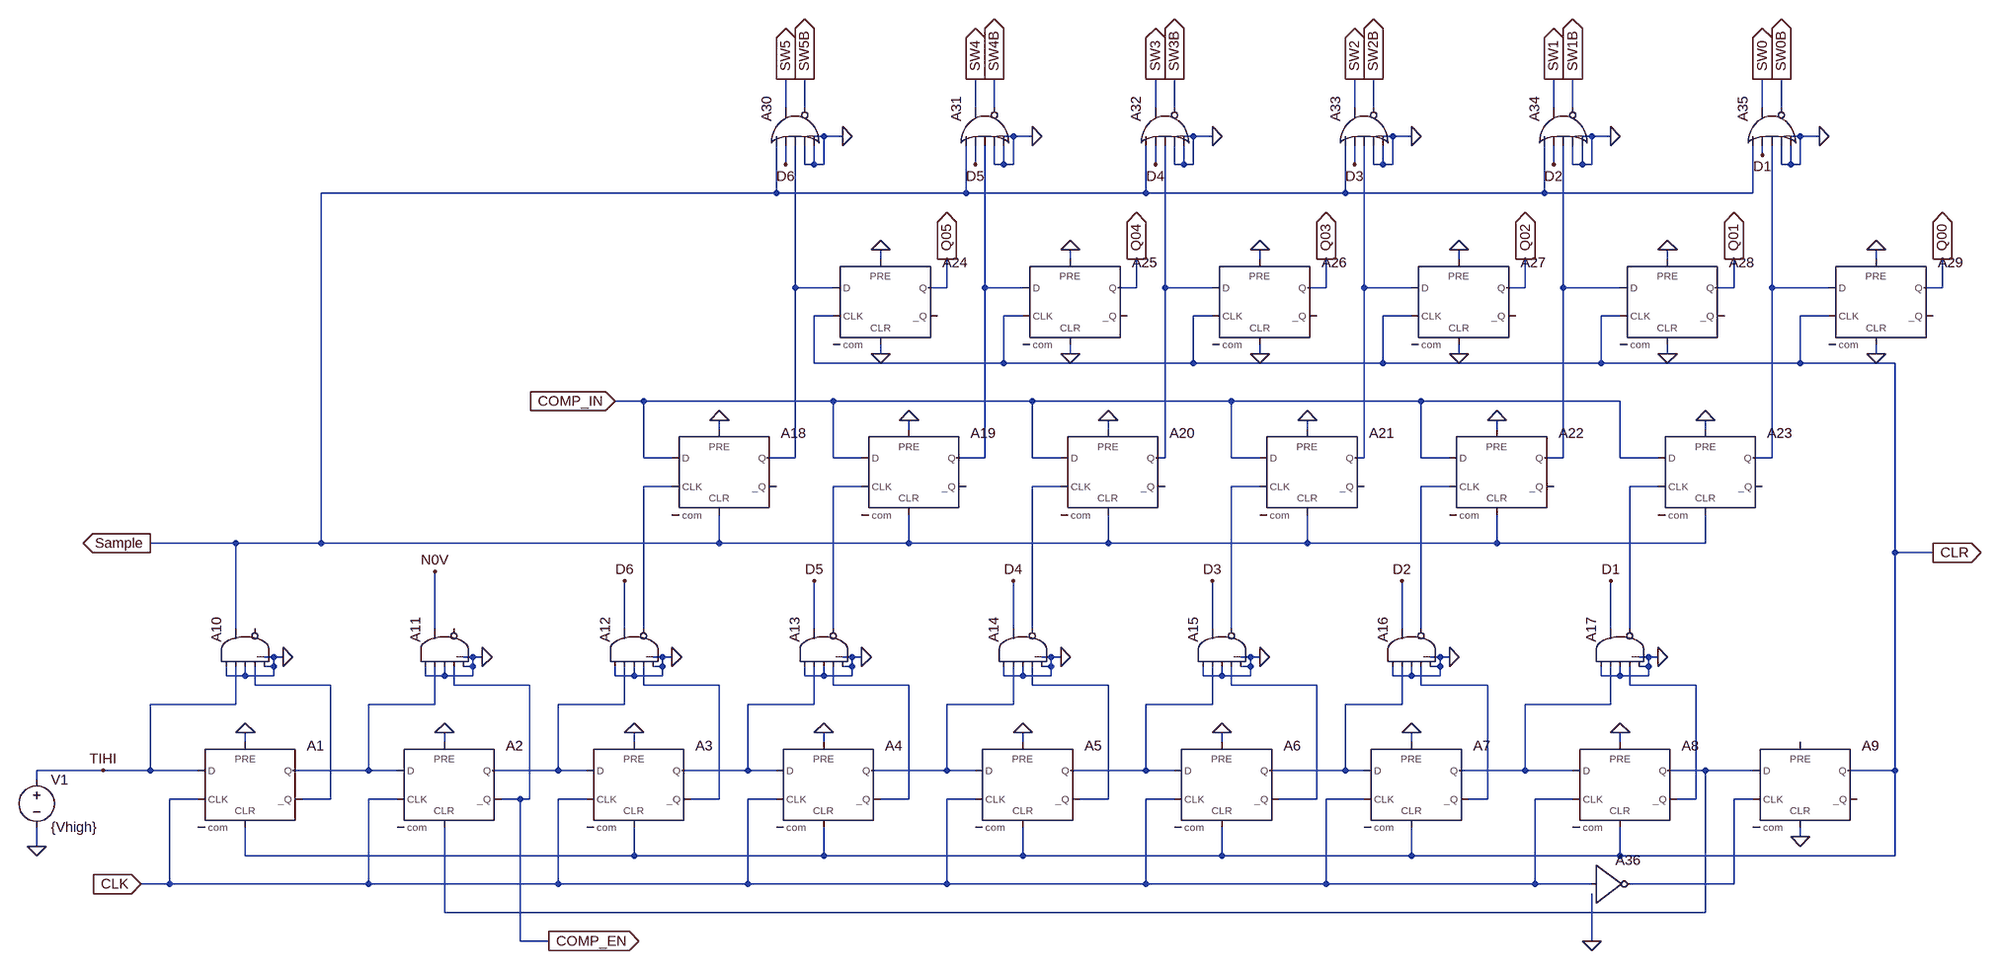
[diagram p0: schematic mySARLogic.asc]
mySARLogic.asc, the LTspice schematic file:
Version 4
SHEET 1 3236 680
WIRE 1152 -1072 1152 -1120
WIRE 1184 -1072 1184 -1120
WIRE 1472 -1072 1472 -1120
WIRE 1504 -1072 1504 -1120
WIRE 1776 -1072 1776 -1120
WIRE 1808 -1072 1808 -1120
WIRE 2112 -1072 2112 -1120
WIRE 2144 -1072 2144 -1120
WIRE 2448 -1072 2448 -1120
WIRE 2480 -1072 2480 -1120
WIRE 2800 -1072 2800 -1120
WIRE 2832 -1072 2832 -1120
WIRE 1216 -1024 1200 -1024
WIRE 1248 -1024 1216 -1024
WIRE 1536 -1024 1520 -1024
WIRE 1568 -1024 1536 -1024
WIRE 1840 -1024 1824 -1024
WIRE 1872 -1024 1840 -1024
WIRE 2176 -1024 2160 -1024
WIRE 2208 -1024 2176 -1024
WIRE 2512 -1024 2496 -1024
WIRE 2544 -1024 2512 -1024
WIRE 2864 -1024 2848 -1024
WIRE 2896 -1024 2864 -1024
WIRE 2800 -992 2800 -1008
WIRE 1152 -976 1152 -1008
WIRE 1184 -976 1184 -1008
WIRE 1200 -976 1200 -1008
WIRE 1200 -976 1184 -976
WIRE 1216 -976 1216 -1024
WIRE 1216 -976 1200 -976
WIRE 1472 -976 1472 -1008
WIRE 1504 -976 1504 -1008
WIRE 1520 -976 1520 -1008
WIRE 1520 -976 1504 -976
WIRE 1536 -976 1536 -1024
WIRE 1536 -976 1520 -976
WIRE 1776 -976 1776 -1008
WIRE 1808 -976 1808 -1008
WIRE 1824 -976 1824 -1008
WIRE 1824 -976 1808 -976
WIRE 1840 -976 1840 -1024
WIRE 1840 -976 1824 -976
WIRE 2112 -976 2112 -1008
WIRE 2144 -976 2144 -1008
WIRE 2160 -976 2160 -1008
WIRE 2160 -976 2144 -976
WIRE 2176 -976 2176 -1024
WIRE 2176 -976 2160 -976
WIRE 2448 -976 2448 -1008
WIRE 2480 -976 2480 -1008
WIRE 2496 -976 2496 -1008
WIRE 2496 -976 2480 -976
WIRE 2512 -976 2512 -1024
WIRE 2512 -976 2496 -976
WIRE 2832 -976 2832 -1008
WIRE 2848 -976 2848 -1008
WIRE 2848 -976 2832 -976
WIRE 2864 -976 2864 -1024
WIRE 2864 -976 2848 -976
WIRE 1136 -928 1136 -1008
WIRE 1136 -928 368 -928
WIRE 1456 -928 1456 -1008
WIRE 1456 -928 1136 -928
WIRE 1760 -928 1760 -1008
WIRE 1760 -928 1456 -928
WIRE 2096 -928 2096 -1008
WIRE 2096 -928 1760 -928
WIRE 2432 -928 2432 -1008
WIRE 2432 -928 2096 -928
WIRE 2784 -928 2784 -1008
WIRE 2784 -928 2432 -928
WIRE 1312 -816 1312 -832
WIRE 1632 -816 1632 -832
WIRE 1952 -816 1952 -832
WIRE 2288 -816 2288 -832
WIRE 2640 -816 2640 -832
WIRE 2992 -816 2992 -832
WIRE 1168 -768 1168 -1008
WIRE 1232 -768 1168 -768
WIRE 1424 -768 1424 -816
WIRE 1424 -768 1392 -768
WIRE 1488 -768 1488 -1008
WIRE 1552 -768 1488 -768
WIRE 1744 -768 1744 -816
WIRE 1744 -768 1712 -768
WIRE 1792 -768 1792 -1008
WIRE 1872 -768 1792 -768
WIRE 2064 -768 2064 -816
WIRE 2064 -768 2032 -768
WIRE 2128 -768 2128 -1008
WIRE 2208 -768 2128 -768
WIRE 2400 -768 2400 -816
WIRE 2400 -768 2368 -768
WIRE 2464 -768 2464 -1008
WIRE 2560 -768 2464 -768
WIRE 2752 -768 2752 -816
WIRE 2752 -768 2720 -768
WIRE 2816 -768 2816 -1008
WIRE 2912 -768 2816 -768
WIRE 3104 -768 3104 -816
WIRE 3104 -768 3072 -768
WIRE 1232 -720 1200 -720
WIRE 1552 -720 1520 -720
WIRE 1872 -720 1840 -720
WIRE 2208 -720 2160 -720
WIRE 2560 -720 2528 -720
WIRE 2912 -720 2864 -720
WIRE 1312 -656 1312 -672
WIRE 1632 -656 1632 -672
WIRE 1952 -656 1952 -672
WIRE 2288 -656 2288 -672
WIRE 2640 -656 2640 -672
WIRE 2992 -656 2992 -672
WIRE 1200 -640 1200 -720
WIRE 1520 -640 1520 -720
WIRE 1520 -640 1200 -640
WIRE 1840 -640 1840 -720
WIRE 1840 -640 1520 -640
WIRE 2160 -640 2160 -720
WIRE 2160 -640 1840 -640
WIRE 2528 -640 2528 -720
WIRE 2528 -640 2160 -640
WIRE 2864 -640 2864 -720
WIRE 2864 -640 2528 -640
WIRE 3024 -640 2864 -640
WIRE 912 -576 864 -576
WIRE 1232 -576 912 -576
WIRE 1568 -576 1232 -576
WIRE 1904 -576 1568 -576
WIRE 2224 -576 1904 -576
WIRE 2560 -576 2224 -576
WIRE 1040 -528 1040 -544
WIRE 1360 -528 1360 -544
WIRE 1696 -528 1696 -544
WIRE 2032 -528 2032 -544
WIRE 2352 -528 2352 -544
WIRE 2704 -528 2704 -544
WIRE 912 -480 912 -576
WIRE 960 -480 912 -480
WIRE 1168 -480 1168 -768
WIRE 1168 -480 1120 -480
WIRE 1232 -480 1232 -576
WIRE 1280 -480 1232 -480
WIRE 1488 -480 1488 -768
WIRE 1488 -480 1440 -480
WIRE 1568 -480 1568 -576
WIRE 1616 -480 1568 -480
WIRE 1792 -480 1792 -768
WIRE 1792 -480 1776 -480
WIRE 1904 -480 1904 -576
WIRE 1952 -480 1904 -480
WIRE 2128 -480 2128 -768
WIRE 2128 -480 2112 -480
WIRE 2224 -480 2224 -576
WIRE 2272 -480 2224 -480
WIRE 2464 -480 2464 -768
WIRE 2464 -480 2432 -480
WIRE 2560 -480 2560 -576
WIRE 2624 -480 2560 -480
WIRE 2816 -480 2816 -768
WIRE 2816 -480 2784 -480
WIRE 960 -432 912 -432
WIRE 1280 -432 1232 -432
WIRE 1616 -432 1568 -432
WIRE 1952 -432 1904 -432
WIRE 2272 -432 2224 -432
WIRE 2624 -432 2576 -432
WIRE 224 -336 80 -336
WIRE 368 -336 368 -928
WIRE 368 -336 224 -336
WIRE 1040 -336 1040 -384
WIRE 1040 -336 368 -336
WIRE 1360 -336 1360 -384
WIRE 1360 -336 1040 -336
WIRE 1696 -336 1696 -384
WIRE 1696 -336 1360 -336
WIRE 2032 -336 2032 -384
WIRE 2032 -336 1696 -336
WIRE 2352 -336 2352 -384
WIRE 2352 -336 2032 -336
WIRE 2704 -336 2704 -384
WIRE 2704 -336 2352 -336
WIRE 3024 -320 3024 -640
WIRE 3088 -320 3024 -320
WIRE 224 -192 224 -336
WIRE 560 -192 560 -288
WIRE 880 -192 880 -272
WIRE 912 -192 912 -432
WIRE 1200 -192 1200 -272
WIRE 1232 -192 1232 -432
WIRE 1536 -192 1536 -272
WIRE 1568 -192 1568 -432
WIRE 1872 -192 1872 -272
WIRE 1904 -192 1904 -432
WIRE 2192 -192 2192 -272
WIRE 2224 -192 2224 -432
WIRE 2544 -192 2544 -272
WIRE 2576 -192 2576 -432
WIRE 288 -144 272 -144
WIRE 304 -144 288 -144
WIRE 624 -144 608 -144
WIRE 640 -144 624 -144
WIRE 944 -144 928 -144
WIRE 960 -144 944 -144
WIRE 1264 -144 1248 -144
WIRE 1280 -144 1264 -144
WIRE 1600 -144 1584 -144
WIRE 1616 -144 1600 -144
WIRE 1936 -144 1920 -144
WIRE 1952 -144 1936 -144
WIRE 2256 -144 2240 -144
WIRE 2272 -144 2256 -144
WIRE 2608 -144 2592 -144
WIRE 2624 -144 2608 -144
WIRE 288 -128 288 -144
WIRE 288 -128 272 -128
WIRE 624 -128 624 -144
WIRE 624 -128 608 -128
WIRE 944 -128 944 -144
WIRE 944 -128 928 -128
WIRE 1264 -128 1264 -144
WIRE 1264 -128 1248 -128
WIRE 1600 -128 1600 -144
WIRE 1600 -128 1584 -128
WIRE 1936 -128 1936 -144
WIRE 1936 -128 1920 -128
WIRE 2256 -128 2256 -144
WIRE 2256 -128 2240 -128
WIRE 2608 -128 2608 -144
WIRE 2608 -128 2592 -128
WIRE 208 -112 208 -128
WIRE 240 -112 240 -128
WIRE 240 -112 208 -112
WIRE 288 -112 288 -128
WIRE 288 -112 240 -112
WIRE 544 -112 544 -128
WIRE 576 -112 576 -128
WIRE 576 -112 544 -112
WIRE 624 -112 624 -128
WIRE 624 -112 576 -112
WIRE 864 -112 864 -128
WIRE 896 -112 896 -128
WIRE 896 -112 864 -112
WIRE 944 -112 944 -128
WIRE 944 -112 896 -112
WIRE 1184 -112 1184 -128
WIRE 1216 -112 1216 -128
WIRE 1216 -112 1184 -112
WIRE 1264 -112 1264 -128
WIRE 1264 -112 1216 -112
WIRE 1520 -112 1520 -128
WIRE 1552 -112 1552 -128
WIRE 1552 -112 1520 -112
WIRE 1600 -112 1600 -128
WIRE 1600 -112 1552 -112
WIRE 1856 -112 1856 -128
WIRE 1888 -112 1888 -128
WIRE 1888 -112 1856 -112
WIRE 1936 -112 1936 -128
WIRE 1936 -112 1888 -112
WIRE 2176 -112 2176 -128
WIRE 2208 -112 2208 -128
WIRE 2208 -112 2176 -112
WIRE 2256 -112 2256 -128
WIRE 2256 -112 2208 -112
WIRE 2528 -112 2528 -128
WIRE 2560 -112 2560 -128
WIRE 2560 -112 2528 -112
WIRE 2608 -112 2608 -128
WIRE 2608 -112 2560 -112
WIRE 256 -96 256 -128
WIRE 384 -96 256 -96
WIRE 592 -96 592 -128
WIRE 720 -96 592 -96
WIRE 912 -96 912 -128
WIRE 1040 -96 912 -96
WIRE 1232 -96 1232 -128
WIRE 1360 -96 1232 -96
WIRE 1568 -96 1568 -128
WIRE 1696 -96 1568 -96
WIRE 1904 -96 1904 -128
WIRE 2048 -96 1904 -96
WIRE 2224 -96 2224 -128
WIRE 2336 -96 2224 -96
WIRE 2576 -96 2576 -128
WIRE 2688 -96 2576 -96
WIRE 224 -64 224 -128
WIRE 224 -64 80 -64
WIRE 560 -64 560 -128
WIRE 560 -64 448 -64
WIRE 880 -64 880 -128
WIRE 880 -64 768 -64
WIRE 1200 -64 1200 -128
WIRE 1200 -64 1088 -64
WIRE 1536 -64 1536 -128
WIRE 1536 -64 1424 -64
WIRE 1872 -64 1872 -128
WIRE 1872 -64 1760 -64
WIRE 2192 -64 2192 -128
WIRE 2192 -64 2096 -64
WIRE 2544 -64 2544 -128
WIRE 2544 -64 2400 -64
WIRE 240 0 240 -16
WIRE 576 0 576 -16
WIRE 896 0 896 -16
WIRE 1216 0 1216 -16
WIRE 1552 0 1552 -16
WIRE 1888 0 1888 -16
WIRE 2208 0 2208 -16
WIRE 2560 0 2560 -16
WIRE 0 48 -112 48
WIRE 80 48 80 -64
WIRE 80 48 0 48
WIRE 160 48 80 48
WIRE 448 48 448 -64
WIRE 448 48 320 48
WIRE 496 48 448 48
WIRE 768 48 768 -64
WIRE 768 48 656 48
WIRE 816 48 768 48
WIRE 1088 48 1088 -64
WIRE 1088 48 976 48
WIRE 1136 48 1088 48
WIRE 1424 48 1424 -64
WIRE 1424 48 1296 48
WIRE 1472 48 1424 48
WIRE 1760 48 1760 -64
WIRE 1760 48 1632 48
WIRE 1808 48 1760 48
WIRE 2096 48 2096 -64
WIRE 2096 48 1968 48
WIRE 2128 48 2096 48
WIRE 2400 48 2400 -64
WIRE 2400 48 2288 48
WIRE 2480 48 2400 48
WIRE 2704 48 2640 48
WIRE 2784 48 2704 48
WIRE 3024 48 3024 -320
WIRE 3024 48 2944 48
WIRE -112 64 -112 48
WIRE 160 96 112 96
WIRE 384 96 384 -96
WIRE 384 96 336 96
WIRE 496 96 448 96
WIRE 704 96 672 96
WIRE 720 96 720 -96
WIRE 720 96 704 96
WIRE 816 96 768 96
WIRE 1040 96 1040 -96
WIRE 1040 96 992 96
WIRE 1136 96 1088 96
WIRE 1360 96 1360 -96
WIRE 1360 96 1312 96
WIRE 1472 96 1424 96
WIRE 1696 96 1696 -96
WIRE 1696 96 1648 96
WIRE 1808 96 1760 96
WIRE 2048 96 2048 -96
WIRE 2048 96 1984 96
WIRE 2128 96 2064 96
WIRE 2336 96 2336 -96
WIRE 2336 96 2304 96
WIRE 2480 96 2416 96
WIRE 2688 96 2688 -96
WIRE 2688 96 2656 96
WIRE 2784 96 2752 96
WIRE 2864 160 2864 144
WIRE -112 176 -112 144
WIRE 240 192 240 144
WIRE 896 192 896 144
WIRE 896 192 240 192
WIRE 1216 192 1216 144
WIRE 1216 192 896 192
WIRE 1552 192 1552 144
WIRE 1552 192 1216 192
WIRE 1888 192 1888 144
WIRE 1888 192 1552 192
WIRE 2208 192 2208 144
WIRE 2208 192 1888 192
WIRE 2560 192 2560 144
WIRE 2560 192 2208 192
WIRE 3024 192 3024 48
WIRE 3024 192 2560 192
WIRE 112 240 112 96
WIRE 112 240 64 240
WIRE 448 240 448 96
WIRE 448 240 112 240
WIRE 768 240 768 96
WIRE 768 240 448 240
WIRE 1088 240 1088 96
WIRE 1088 240 768 240
WIRE 1424 240 1424 96
WIRE 1424 240 1088 240
WIRE 1760 240 1760 96
WIRE 1760 240 1424 240
WIRE 2064 240 2064 96
WIRE 2064 240 1760 240
WIRE 2416 240 2416 96
WIRE 2416 240 2064 240
WIRE 2512 240 2416 240
WIRE 2752 240 2752 96
WIRE 2752 240 2576 240
WIRE 576 288 576 144
WIRE 2704 288 2704 48
WIRE 2704 288 576 288
WIRE 704 336 704 96
WIRE 752 336 704 336
WIRE 2512 336 2512 256
FLAG 1248 -1024 0
FLAG 1040 -544 0
FLAG 1360 -544 0
FLAG 1696 -544 0
FLAG 2032 -544 0
FLAG 2352 -544 0
FLAG 2704 -544 0
FLAG 1312 -832 0
FLAG 1632 -832 0
FLAG 1952 -832 0
FLAG 2288 -832 0
FLAG 2640 -832 0
FLAG 2992 -832 0
FLAG 1312 -656 0
FLAG 1632 -656 0
FLAG 1952 -656 0
FLAG 2288 -656 0
FLAG 2640 -656 0
FLAG 2992 -656 0
FLAG 304 -144 0
FLAG 240 -16 0
FLAG 576 -16 0
FLAG 896 -16 0
FLAG 1216 -16 0
FLAG 1552 -16 0
FLAG 1888 -16 0
FLAG 2208 -16 0
FLAG 2560 -16 0
FLAG 640 -144 0
FLAG 960 -144 0
FLAG 1280 -144 0
FLAG 1616 -144 0
FLAG 1952 -144 0
FLAG 2272 -144 0
FLAG 2624 -144 0
FLAG 1568 -1024 0
FLAG 1872 -1024 0
FLAG 2208 -1024 0
FLAG 2544 -1024 0
FLAG 2896 -1024 0
FLAG 64 240 CLK
IOPIN 64 240 In
FLAG 864 -576 COMP_IN
IOPIN 864 -576 In
FLAG 752 336 COMP_EN
IOPIN 752 336 Out
FLAG -112 176 0
FLAG 2864 160 0
FLAG 2512 336 0
FLAG 80 -336 Sample
IOPIN 80 -336 Out
FLAG 880 -272 D6
FLAG 1200 -272 D5
FLAG 1536 -272 D4
FLAG 1872 -272 D3
FLAG 2192 -272 D2
FLAG 2544 -272 D1
FLAG 1424 -816 Q05
IOPIN 1424 -816 Out
FLAG 1744 -816 Q04
IOPIN 1744 -816 Out
FLAG 2064 -816 Q03
IOPIN 2064 -816 Out
FLAG 2400 -816 Q02
IOPIN 2400 -816 Out
FLAG 2752 -816 Q01
IOPIN 2752 -816 Out
FLAG 3104 -816 Q00
IOPIN 3104 -816 Out
FLAG 1152 -976 D6
FLAG 1472 -976 D5
FLAG 1776 -976 D4
FLAG 2112 -976 D3
FLAG 2448 -976 D2
FLAG 2800 -992 D1
FLAG 1152 -1120 SW5
IOPIN 1152 -1120 Out
FLAG 1184 -1120 SW5B
IOPIN 1184 -1120 Out
FLAG 1472 -1120 SW4
IOPIN 1472 -1120 Out
FLAG 1504 -1120 SW4B
IOPIN 1504 -1120 Out
FLAG 1776 -1120 SW3
IOPIN 1776 -1120 Out
FLAG 1808 -1120 SW3B
IOPIN 1808 -1120 Out
FLAG 2112 -1120 SW2
IOPIN 2112 -1120 Out
FLAG 2144 -1120 SW2B
IOPIN 2144 -1120 Out
FLAG 2448 -1120 SW1
IOPIN 2448 -1120 Out
FLAG 2480 -1120 SW1B
IOPIN 2480 -1120 Out
FLAG 2800 -1120 SW0
IOPIN 2800 -1120 Out
FLAG 2832 -1120 SW0B
IOPIN 2832 -1120 Out
FLAG 0 48 TIHI
FLAG 560 -288 N0V
FLAG 3088 -320 CLR
IOPIN 3088 -320 Out
SYMBOL Digital\\dflop 240 0 R0
SYMATTR InstName A1
SYMATTR SpiceLine Vhigh={Vhigh} Vlow={Vlow} Td={Td} Trise={Trise}
SYMBOL Digital\\and 176 -160 R270
SYMATTR InstName A10
SYMATTR SpiceLine Trise={Trise} Td={Td} Vhigh={Vhigh}
SYMBOL Digital\\or 1104 -1040 R270
SYMATTR InstName A30
SYMATTR SpiceLine Trise={Trise} Td={Td} Vhigh={Vhigh}
SYMBOL voltage -112 48 R0
WINDOW 123 0 0 Left 0
WINDOW 39 0 0 Left 0
SYMATTR InstName V1
SYMATTR Value {Vhigh}
SYMBOL Digital\\inv 2512 176 R0
SYMATTR InstName A36
SYMATTR SpiceLine Trise={Trise} Vhigh={Vhigh}
SYMBOL Digital\\dflop 576 0 R0
SYMATTR InstName A2
SYMATTR SpiceLine Vhigh={Vhigh} Vlow={Vlow} Td={Td} Trise={Trise}
SYMBOL Digital\\dflop 896 0 R0
SYMATTR InstName A3
SYMATTR SpiceLine Vhigh={Vhigh} Vlow={Vlow} Td={Td} Trise={Trise}
SYMBOL Digital\\dflop 1216 0 R0
SYMATTR InstName A4
SYMATTR SpiceLine Vhigh={Vhigh} Vlow={Vlow} Td={Td} Trise={Trise}
SYMBOL Digital\\dflop 1552 0 R0
SYMATTR InstName A5
SYMATTR SpiceLine Vhigh={Vhigh} Vlow={Vlow} Td={Td} Trise={Trise}
SYMBOL Digital\\dflop 1888 0 R0
SYMATTR InstName A6
SYMATTR SpiceLine Vhigh={Vhigh} Vlow={Vlow} Td={Td} Trise={Trise}
SYMBOL Digital\\dflop 2208 0 R0
SYMATTR InstName A7
SYMATTR SpiceLine Vhigh={Vhigh} Vlow={Vlow} Td={Td} Trise={Trise}
SYMBOL Digital\\dflop 2560 0 R0
SYMATTR InstName A8
SYMATTR SpiceLine Vhigh={Vhigh} Vlow={Vlow} Td={Td} Trise={Trise}
SYMBOL Digital\\dflop 2864 0 R0
SYMATTR InstName A9
SYMATTR SpiceLine Vhigh={Vhigh} Vlow={Vlow} Td={Td} Trise={Trise}
SYMBOL Digital\\dflop 1040 -528 R0
SYMATTR InstName A18
SYMATTR SpiceLine Vhigh={Vhigh} Vlow={Vlow} Td={Td} Trise={Trise}
SYMBOL Digital\\dflop 1360 -528 R0
SYMATTR InstName A19
SYMATTR SpiceLine Vhigh={Vhigh} Vlow={Vlow} Td={Td} Trise={Trise}
SYMBOL Digital\\dflop 1696 -528 R0
SYMATTR InstName A20
SYMATTR SpiceLine Vhigh={Vhigh} Vlow={Vlow} Td={Td} Trise={Trise}
SYMBOL Digital\\dflop 2032 -528 R0
SYMATTR InstName A21
SYMATTR SpiceLine Vhigh={Vhigh} Vlow={Vlow} Td={Td} Trise={Trise}
SYMBOL Digital\\dflop 2352 -528 R0
SYMATTR InstName A22
SYMATTR SpiceLine Vhigh={Vhigh} Vlow={Vlow} Td={Td} Trise={Trise}
SYMBOL Digital\\dflop 2704 -528 R0
SYMATTR InstName A23
SYMATTR SpiceLine Vhigh={Vhigh} Vlow={Vlow} Td={Td} Trise={Trise}
SYMBOL Digital\\dflop 1312 -816 R0
SYMATTR InstName A24
SYMATTR SpiceLine Vhigh={Vhigh} Vlow={Vlow} Td={Td} Trise={Trise}
SYMBOL Digital\\dflop 1632 -816 R0
SYMATTR InstName A25
SYMATTR SpiceLine Vhigh={Vhigh} Vlow={Vlow} Td={Td} Trise={Trise}
SYMBOL Digital\\dflop 1952 -816 R0
SYMATTR InstName A26
SYMATTR SpiceLine Vhigh={Vhigh} Vlow={Vlow} Td={Td} Trise={Trise}
SYMBOL Digital\\dflop 2288 -816 R0
SYMATTR InstName A27
SYMATTR SpiceLine Vhigh={Vhigh} Vlow={Vlow} Td={Td} Trise={Trise}
SYMBOL Digital\\dflop 2640 -816 R0
SYMATTR InstName A28
SYMATTR SpiceLine Vhigh={Vhigh} Vlow={Vlow} Td={Td} Trise={Trise}
SYMBOL Digital\\dflop 2992 -816 R0
SYMATTR InstName A29
SYMATTR SpiceLine Vhigh={Vhigh} Vlow={Vlow} Td={Td} Trise={Trise}
SYMBOL Digital\\and 512 -160 R270
SYMATTR InstName A11
SYMATTR SpiceLine Trise={Trise} Td={Td} Vhigh={Vhigh}
SYMBOL Digital\\and 832 -160 R270
SYMATTR InstName A12
SYMATTR SpiceLine Trise={Trise} Td={Td} Vhigh={Vhigh}
SYMBOL Digital\\and 1152 -160 R270
SYMATTR InstName A13
SYMATTR SpiceLine Trise={Trise} Td={Td} Vhigh={Vhigh}
SYMBOL Digital\\and 1488 -160 R270
SYMATTR InstName A14
SYMATTR SpiceLine Trise={Trise} Td={Td} Vhigh={Vhigh}
SYMBOL Digital\\and 1824 -160 R270
SYMATTR InstName A15
SYMATTR SpiceLine Trise={Trise} Td={Td} Vhigh={Vhigh}
SYMBOL Digital\\and 2144 -160 R270
SYMATTR InstName A16
SYMATTR SpiceLine Trise={Trise} Td={Td} Vhigh={Vhigh}
SYMBOL Digital\\and 2496 -160 R270
SYMATTR InstName A17
SYMATTR SpiceLine Trise={Trise} Td={Td} Vhigh={Vhigh}
SYMBOL Digital\\or 1424 -1040 R270
SYMATTR InstName A31
SYMATTR SpiceLine Trise={Trise} Td={Td} Vhigh={Vhigh}
SYMBOL Digital\\or 1728 -1040 R270
SYMATTR InstName A32
SYMATTR SpiceLine Trise={Trise} Td={Td} Vhigh={Vhigh}
SYMBOL Digital\\or 2064 -1040 R270
SYMATTR InstName A33
SYMATTR SpiceLine Trise={Trise} Td={Td} Vhigh={Vhigh}
SYMBOL Digital\\or 2400 -1040 R270
SYMATTR InstName A34
SYMATTR SpiceLine Trise={Trise} Td={Td} Vhigh={Vhigh}
SYMBOL Digital\\or 2752 -1040 R270
SYMATTR InstName A35
SYMATTR SpiceLine Trise={Trise} Td={Td} Vhigh={Vhigh}

The netlist it stands for:
* mySARLogic.asc
A1 TIHI 0 CLK 0 CLR N013 N020 0 DFLOP Vhigh={Vhigh} Vlow={Vlow} Td={Td} Trise={Trise}
A10 0 TIHI 0 N013 0 0 Sample 0 AND Trise={Trise} Td={Td} Vhigh={Vhigh}
A30 Sample D6 N001 0 0 SW5B SW5 0 OR Trise={Trise} Td={Td} Vhigh={Vhigh}
V1 TIHI 0 {Vhigh}
A36 CLK 0 0 0 0 N028 0 0 BUF Trise={Trise} Vhigh={Vhigh}
A2 N020 0 CLK 0 N027 COMP_EN N021 0 DFLOP Vhigh={Vhigh} Vlow={Vlow} Td={Td} Trise={Trise}
A3 N021 0 CLK 0 CLR N014 N022 0 DFLOP Vhigh={Vhigh} Vlow={Vlow} Td={Td} Trise={Trise}
A4 N022 0 CLK 0 CLR N015 N023 0 DFLOP Vhigh={Vhigh} Vlow={Vlow} Td={Td} Trise={Trise}
A5 N023 0 CLK 0 CLR N016 N024 0 DFLOP Vhigh={Vhigh} Vlow={Vlow} Td={Td} Trise={Trise}
A6 N024 0 CLK 0 CLR N017 N025 0 DFLOP Vhigh={Vhigh} Vlow={Vlow} Td={Td} Trise={Trise}
A7 N025 0 CLK 0 CLR N018 N026 0 DFLOP Vhigh={Vhigh} Vlow={Vlow} Td={Td} Trise={Trise}
A8 N026 0 CLK 0 CLR N019 N027 0 DFLOP Vhigh={Vhigh} Vlow={Vlow} Td={Td} Trise={Trise}
A9 N027 0 N028 0 0 0 CLR 0 DFLOP Vhigh={Vhigh} Vlow={Vlow} Td={Td} Trise={Trise}
A18 COMP_IN 0 N007 0 Sample 0 N001 0 DFLOP Vhigh={Vhigh} Vlow={Vlow} Td={Td} Trise={Trise}
A19 COMP_IN 0 N008 0 Sample 0 N002 0 DFLOP Vhigh={Vhigh} Vlow={Vlow} Td={Td} Trise={Trise}
A20 COMP_IN 0 N009 0 Sample 0 N003 0 DFLOP Vhigh={Vhigh} Vlow={Vlow} Td={Td} Trise={Trise}
A21 COMP_IN 0 N010 0 Sample 0 N004 0 DFLOP Vhigh={Vhigh} Vlow={Vlow} Td={Td} Trise={Trise}
A22 COMP_IN 0 N011 0 Sample 0 N005 0 DFLOP Vhigh={Vhigh} Vlow={Vlow} Td={Td} Trise={Trise}
A23 COMP_IN 0 N012 0 Sample 0 N006 0 DFLOP Vhigh={Vhigh} Vlow={Vlow} Td={Td} Trise={Trise}
A24 N001 0 CLR 0 0 0 Q05 0 DFLOP Vhigh={Vhigh} Vlow={Vlow} Td={Td} Trise={Trise}
A25 N002 0 CLR 0 0 0 Q04 0 DFLOP Vhigh={Vhigh} Vlow={Vlow} Td={Td} Trise={Trise}
A26 N003 0 CLR 0 0 0 Q03 0 DFLOP Vhigh={Vhigh} Vlow={Vlow} Td={Td} Trise={Trise}
A27 N004 0 CLR 0 0 0 Q02 0 DFLOP Vhigh={Vhigh} Vlow={Vlow} Td={Td} Trise={Trise}
A28 N005 0 CLR 0 0 0 Q01 0 DFLOP Vhigh={Vhigh} Vlow={Vlow} Td={Td} Trise={Trise}
A29 N006 0 CLR 0 0 0 Q00 0 DFLOP Vhigh={Vhigh} Vlow={Vlow} Td={Td} Trise={Trise}
A11 0 N020 0 COMP_EN 0 0 N0V 0 AND Trise={Trise} Td={Td} Vhigh={Vhigh}
A12 0 N021 0 N014 0 N007 D6 0 AND Trise={Trise} Td={Td} Vhigh={Vhigh}
A13 0 N022 0 N015 0 N008 D5 0 AND Trise={Trise} Td={Td} Vhigh={Vhigh}
A14 0 N023 0 N016 0 N009 D4 0 AND Trise={Trise} Td={Td} Vhigh={Vhigh}
A15 0 N024 0 N017 0 N010 D3 0 AND Trise={Trise} Td={Td} Vhigh={Vhigh}
A16 0 N025 0 N018 0 N011 D2 0 AND Trise={Trise} Td={Td} Vhigh={Vhigh}
A17 0 N026 0 N019 0 N012 D1 0 AND Trise={Trise} Td={Td} Vhigh={Vhigh}
A31 Sample D5 N002 0 0 SW4B SW4 0 OR Trise={Trise} Td={Td} Vhigh={Vhigh}
A32 Sample D4 N003 0 0 SW3B SW3 0 OR Trise={Trise} Td={Td} Vhigh={Vhigh}
A33 Sample D3 N004 0 0 SW2B SW2 0 OR Trise={Trise} Td={Td} Vhigh={Vhigh}
A34 Sample D2 N005 0 0 SW1B SW1 0 OR Trise={Trise} Td={Td} Vhigh={Vhigh}
A35 Sample D1 N006 0 0 SW0B SW0 0 OR Trise={Trise} Td={Td} Vhigh={Vhigh}
.backanno
.end